# Altium schematic sheet op-amp.SchDoc
size A; SheetNumber: 3; SheetTotal: 4
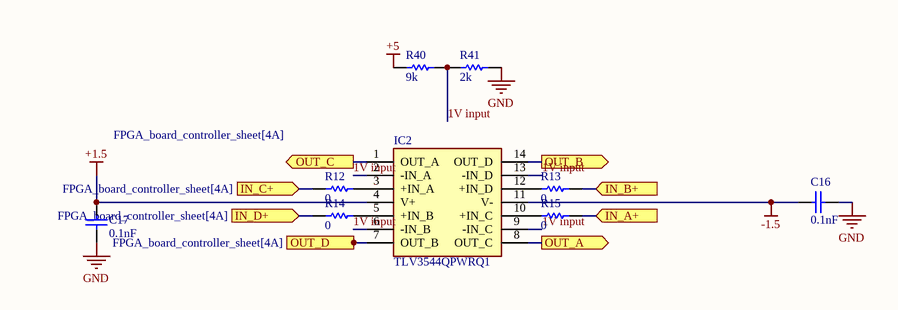
[diagram p0: op-amp.SchDoc]

## Parts
C16  0.1nF  [C0603]
C17  0.1nF  [C0603]
IC2  TLV3544QPWRQ1  [SOP65P640X120-14N]
R12  0  [R0603]
R13  0  [R0603]
R14  0  [R0603]
R15  0  [R0603]
R40  9k  [R0603]
R41  2k  [R0603]

## Ports
IN_A+ (in, see FPGA_board_controller_sheet[4A]), IN_B+ (in, see FPGA_board_controller_sheet[4A]), IN_C+ (in, see FPGA_board_controller_sheet[4A]), IN_D+ (in, see FPGA_board_controller_sheet[4A]), OUT_A (out, see FPGA_board_controller_sheet[4A]), OUT_B (out, see FPGA_board_controller_sheet[4A]), OUT_C (out, see FPGA_board_controller_sheet[4A]), OUT_D (out, see FPGA_board_controller_sheet[4A])

## Nets
+1.5: C17.2 IC2.4(V+)
+5: R40.1
-1.5: C16.1 IC2.11(V-)
GND: C16.2 C17.1 R41.2
1V input: IC2.2(-IN_A) IC2.6(-IN_B) IC2.9(-IN_C) IC2.13(-IN_D) R40.2 R41.1
IN_A+: R15.2 ; port IN_A+
IN_B+: R13.2 ; port IN_B+
IN_C+: R12.1 ; port IN_C+
IN_D+: R14.1 ; port IN_D+
OUT_A: IC2.8(OUT_C) ; port OUT_A
OUT_B: IC2.14(OUT_D) ; port OUT_B
OUT_C: IC2.1(OUT_A) ; port OUT_C
OUT_D: IC2.7(OUT_B) ; port OUT_D
NetIC2_3: IC2.3(+IN_A) R12.2
NetIC2_5: IC2.5(+IN_B) R14.2
NetIC2_10: IC2.10(+IN_C) R15.1
NetIC2_12: IC2.12(+IN_D) R13.1

## Library data of the parts
C16 C17 = Cap: value: *
IC2 = TLV3544QPWRQ1: Integrated Circuit; Manufacturer_Name: Texas Instruments; Datasheet Link: http://www.ti.com/lit/gpn/tlv3544-q1; Height: 1.2mm; Manufacturer_Part_Number: TLV3544QPWRQ1; Mouser Part Number: 595-TLV3544QPWRQ1; Mouser Price/Stock: https://www.mouser.co.uk/ProductDetail/Texas-Instruments/TLV3544QPWRQ1?qs=xhbEVWpZdWeZ7jRiLWDiEw%3D%3D; Arrow Part Number: TLV3544QPWRQ1; Arrow Price/Stock: https://www.arrow.com/en/products/tlv3544qpwrq1/texas-instruments
R12-R15 R40 R41 = Resistor: value: *